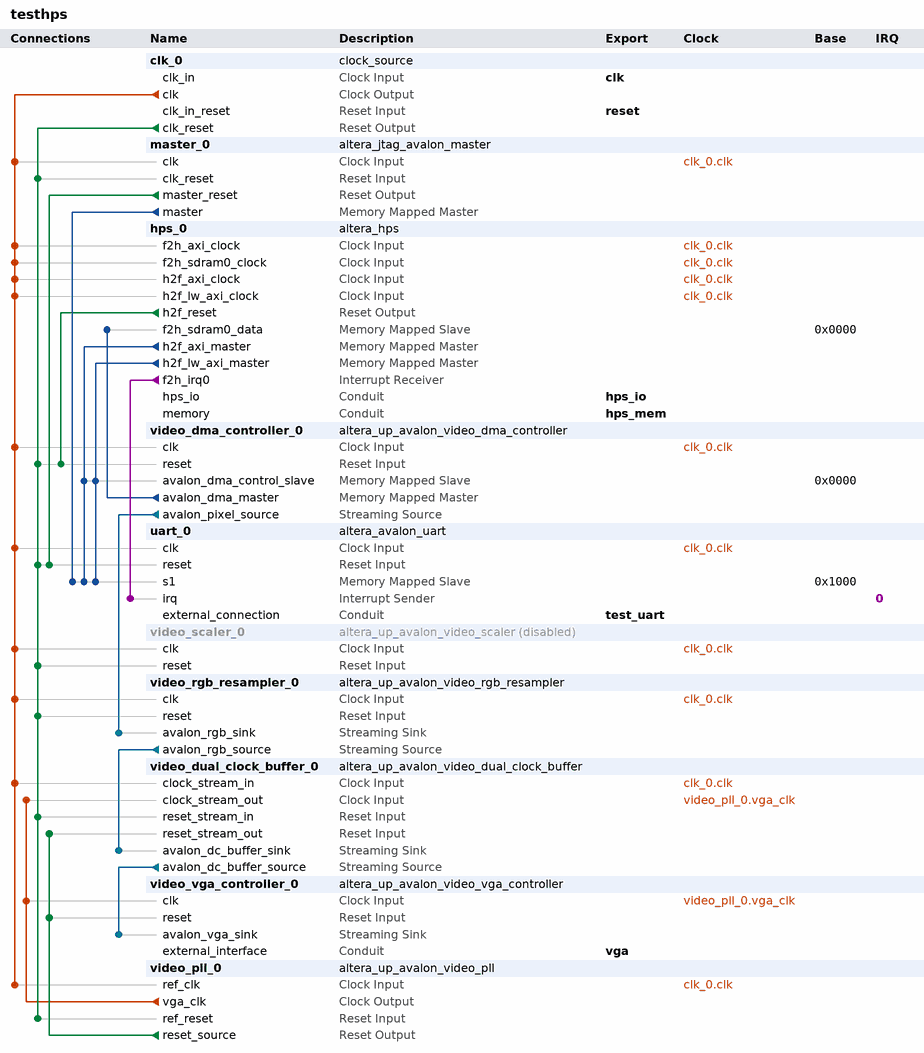
[diagram p0: system contents]
# Platform Designer (Qsys) system testhps, Cyclone V 5CSEMA5F31C6
# Parameters at their usual value, and those the tool derives, are not listed.
package require -exact qsys 15.0
create_system testhps
set_project_property DEVICE_FAMILY {Cyclone V}
set_project_property DEVICE 5CSEMA5F31C6

add_instance clk_0 clock_source 15.0
set_instance_parameter_value clk_0 clockFrequency 50000000

add_instance master_0 altera_jtag_avalon_master 15.0

add_instance hps_0 altera_hps 15.0
set_instance_parameter_value hps_0 EMAC1_Mode RGMII
set_instance_parameter_value hps_0 EMAC1_PinMuxing {HPS I/O Set 0}
set_instance_parameter_value hps_0 F2SCLK_COLDRST_Enable false
set_instance_parameter_value hps_0 F2SCLK_DBGRST_Enable false
set_instance_parameter_value hps_0 F2SCLK_WARMRST_Enable false
set_instance_parameter_value hps_0 F2SDRAM_Type {Avalon-MM Bidirectional,Avalon-MM Bidirectional}
set_instance_parameter_value hps_0 F2SDRAM_Width 32,32
set_instance_parameter_value hps_0 F2SINTERRUPT_Enable true
set_instance_parameter_value hps_0 F2S_Width 1
set_instance_parameter_value hps_0 FPGA_PERIPHERAL_OUTPUT_CLOCK_FREQ_EMAC0_GTX_CLK 100
set_instance_parameter_value hps_0 FPGA_PERIPHERAL_OUTPUT_CLOCK_FREQ_EMAC0_MD_CLK 2.5
set_instance_parameter_value hps_0 FPGA_PERIPHERAL_OUTPUT_CLOCK_FREQ_EMAC1_GTX_CLK 100
set_instance_parameter_value hps_0 FPGA_PERIPHERAL_OUTPUT_CLOCK_FREQ_EMAC1_MD_CLK 2.5
set_instance_parameter_value hps_0 HPS_PROTOCOL DDR3
set_instance_parameter_value hps_0 I2C0_Mode I2C
set_instance_parameter_value hps_0 I2C0_PinMuxing {HPS I/O Set 1}
set_instance_parameter_value hps_0 I2C1_Mode N/A
set_instance_parameter_value hps_0 I2C1_PinMuxing Unused
set_instance_parameter_value hps_0 LWH2F_Enable true
set_instance_parameter_value hps_0 MEM_BANKADDR_WIDTH 3
set_instance_parameter_value hps_0 MEM_CLK_FREQ 400.0
set_instance_parameter_value hps_0 MEM_COL_ADDR_WIDTH 10
set_instance_parameter_value hps_0 MEM_DQ_WIDTH 32
set_instance_parameter_value hps_0 MEM_DRV_STR RZQ/7
set_instance_parameter_value hps_0 MEM_ROW_ADDR_WIDTH 15
set_instance_parameter_value hps_0 MEM_RTT_NOM RZQ/4
set_instance_parameter_value hps_0 MEM_RTT_WR RZQ/4
set_instance_parameter_value hps_0 MEM_TCL 11
set_instance_parameter_value hps_0 MEM_TFAW_NS 30.0
set_instance_parameter_value hps_0 MEM_TRAS_NS 35.0
set_instance_parameter_value hps_0 MEM_TRCD_NS 13.75
set_instance_parameter_value hps_0 MEM_TRFC_NS 260.0
set_instance_parameter_value hps_0 MEM_TRP_NS 13.75
set_instance_parameter_value hps_0 MEM_VENDOR Other
set_instance_parameter_value hps_0 MEM_WTCL 8
set_instance_parameter_value hps_0 QSPI_Mode {1 SS}
set_instance_parameter_value hps_0 QSPI_PinMuxing {HPS I/O Set 0}
set_instance_parameter_value hps_0 REF_CLK_FREQ 25.0
set_instance_parameter_value hps_0 S2F_Width 1
set_instance_parameter_value hps_0 SDIO_Mode {4-bit Data}
set_instance_parameter_value hps_0 SDIO_PinMuxing {HPS I/O Set 0}
set_instance_parameter_value hps_0 SPIM1_Mode N/A
set_instance_parameter_value hps_0 SPIM1_PinMuxing Unused
set_instance_parameter_value hps_0 STM_Enable false
set_instance_parameter_value hps_0 TIMING_BOARD_AC_SKEW 0.02
set_instance_parameter_value hps_0 TIMING_BOARD_AC_TO_CK_SKEW 0.01
set_instance_parameter_value hps_0 TIMING_BOARD_DQ_TO_DQS_SKEW 0.05
set_instance_parameter_value hps_0 TIMING_BOARD_MAX_CK_DELAY 0.03
set_instance_parameter_value hps_0 TIMING_BOARD_MAX_DQS_DELAY 0.02
set_instance_parameter_value hps_0 TIMING_BOARD_SKEW_BETWEEN_DQS 0.06
set_instance_parameter_value hps_0 TIMING_BOARD_SKEW_CKDQS_DIMM_MAX 0.12
set_instance_parameter_value hps_0 TIMING_BOARD_SKEW_CKDQS_DIMM_MIN 0.06
set_instance_parameter_value hps_0 TIMING_BOARD_SKEW_WITHIN_DQS 0.01
set_instance_parameter_value hps_0 TIMING_TDH 65
set_instance_parameter_value hps_0 TIMING_TDQSCK 255
set_instance_parameter_value hps_0 TIMING_TDQSQ 125
set_instance_parameter_value hps_0 TIMING_TDS 30
set_instance_parameter_value hps_0 TIMING_TIH 140
set_instance_parameter_value hps_0 TIMING_TIS 180
set_instance_parameter_value hps_0 TIMING_TQSH 0.4
set_instance_parameter_value hps_0 UART0_Mode {No Flow Control}
set_instance_parameter_value hps_0 UART0_PinMuxing {HPS I/O Set 2}
set_instance_parameter_value hps_0 USB1_Mode SDR
set_instance_parameter_value hps_0 USB1_PinMuxing {HPS I/O Set 0}
set_instance_parameter_value hps_0 desired_cfg_clk_mhz 100.0
set_instance_parameter_value hps_0 desired_qspi_clk_mhz 400.0

add_instance video_dma_controller_0 altera_up_avalon_video_dma_controller 15.0
set_instance_parameter_value video_dma_controller_0 addr_mode Consecutive
set_instance_parameter_value video_dma_controller_0 back_start_address 0
set_instance_parameter_value video_dma_controller_0 color_bits 8
set_instance_parameter_value video_dma_controller_0 color_planes 3
set_instance_parameter_value video_dma_controller_0 dma_enabled true
set_instance_parameter_value video_dma_controller_0 height 480
set_instance_parameter_value video_dma_controller_0 mode {From Memory to Stream}
set_instance_parameter_value video_dma_controller_0 start_address 0
set_instance_parameter_value video_dma_controller_0 width 640

add_instance uart_0 altera_avalon_uart 15.0
set_instance_parameter_value uart_0 baud 115200
set_instance_parameter_value uart_0 dataBits 8
set_instance_parameter_value uart_0 fixedBaud false
set_instance_parameter_value uart_0 parity NONE
set_instance_parameter_value uart_0 stopBits 1

add_instance video_scaler_0 altera_up_avalon_video_scaler 15.0
set_instance_property video_scaler_0 ENABLED false
set_instance_parameter_value video_scaler_0 color_bits 8
set_instance_parameter_value video_scaler_0 color_planes 3
set_instance_parameter_value video_scaler_0 height_in 120
set_instance_parameter_value video_scaler_0 height_scaling 4
set_instance_parameter_value video_scaler_0 width_in 160
set_instance_parameter_value video_scaler_0 width_scaling 4

add_instance video_rgb_resampler_0 altera_up_avalon_video_rgb_resampler 15.0
set_instance_parameter_value video_rgb_resampler_0 alpha 1023
set_instance_parameter_value video_rgb_resampler_0 input_type {24-bit RGB}
set_instance_parameter_value video_rgb_resampler_0 output_type {30-bit RGB}

add_instance video_dual_clock_buffer_0 altera_up_avalon_video_dual_clock_buffer 15.0
set_instance_parameter_value video_dual_clock_buffer_0 color_bits 10

add_instance video_vga_controller_0 altera_up_avalon_video_vga_controller 15.0
set_instance_parameter_value video_vga_controller_0 board DE1-SoC
set_instance_parameter_value video_vga_controller_0 resolution {VGA 640x480}

add_instance video_pll_0 altera_up_avalon_video_pll 15.0
set_instance_parameter_value video_pll_0 camera {5MP Digital Camera}
set_instance_parameter_value video_pll_0 gui_refclk 50.0
set_instance_parameter_value video_pll_0 lcd {7" LCD on VEEK-MT and MTL Module}

# connections
add_connection clk_0.clk hps_0.f2h_axi_clock clock
add_connection clk_0.clk hps_0.f2h_sdram0_clock clock
add_connection clk_0.clk hps_0.h2f_axi_clock clock
add_connection clk_0.clk hps_0.h2f_lw_axi_clock clock
add_connection clk_0.clk master_0.clk clock
add_connection clk_0.clk uart_0.clk clock
add_connection clk_0.clk video_dma_controller_0.clk clock
add_connection clk_0.clk video_dual_clock_buffer_0.clock_stream_in clock
add_connection clk_0.clk video_pll_0.ref_clk clock
add_connection clk_0.clk video_rgb_resampler_0.clk clock
add_connection clk_0.clk video_scaler_0.clk clock
add_connection video_pll_0.vga_clk video_dual_clock_buffer_0.clock_stream_out clock
add_connection video_pll_0.vga_clk video_vga_controller_0.clk clock
add_connection clk_0.clk_reset master_0.clk_reset reset
add_connection clk_0.clk_reset uart_0.reset reset
add_connection clk_0.clk_reset video_dma_controller_0.reset reset
add_connection clk_0.clk_reset video_dual_clock_buffer_0.reset_stream_in reset
add_connection clk_0.clk_reset video_pll_0.ref_reset reset
add_connection clk_0.clk_reset video_rgb_resampler_0.reset reset
add_connection clk_0.clk_reset video_scaler_0.reset reset
add_connection hps_0.h2f_reset video_dma_controller_0.reset reset
add_connection master_0.master_reset uart_0.reset reset
add_connection video_pll_0.reset_source video_dual_clock_buffer_0.reset_stream_out reset
add_connection video_pll_0.reset_source video_vga_controller_0.reset reset
add_connection hps_0.h2f_axi_master uart_0.s1 avalon
set_connection_parameter_value hps_0.h2f_axi_master/uart_0.s1 baseAddress 0x1000
add_connection hps_0.h2f_axi_master video_dma_controller_0.avalon_dma_control_slave avalon
set_connection_parameter_value hps_0.h2f_axi_master/video_dma_controller_0.avalon_dma_control_slave baseAddress 0x0000
add_connection hps_0.h2f_lw_axi_master uart_0.s1 avalon
set_connection_parameter_value hps_0.h2f_lw_axi_master/uart_0.s1 baseAddress 0x1000
add_connection hps_0.h2f_lw_axi_master video_dma_controller_0.avalon_dma_control_slave avalon
set_connection_parameter_value hps_0.h2f_lw_axi_master/video_dma_controller_0.avalon_dma_control_slave baseAddress 0x0000
add_connection master_0.master uart_0.s1 avalon
set_connection_parameter_value master_0.master/uart_0.s1 baseAddress 0x1000
add_connection video_dma_controller_0.avalon_dma_master hps_0.f2h_sdram0_data avalon
set_connection_parameter_value video_dma_controller_0.avalon_dma_master/hps_0.f2h_sdram0_data baseAddress 0x0000
add_connection video_dma_controller_0.avalon_pixel_source video_rgb_resampler_0.avalon_rgb_sink avalon_streaming
add_connection video_dual_clock_buffer_0.avalon_dc_buffer_source video_vga_controller_0.avalon_vga_sink avalon_streaming
add_connection video_rgb_resampler_0.avalon_rgb_source video_dual_clock_buffer_0.avalon_dc_buffer_sink avalon_streaming
add_connection hps_0.f2h_irq0 uart_0.irq interrupt
set_connection_parameter_value hps_0.f2h_irq0/uart_0.irq irqNumber 0

# exported interfaces
add_interface clk clock sink
set_interface_property clk EXPORT_OF clk_0.clk_in
add_interface hps_io conduit end
set_interface_property hps_io EXPORT_OF hps_0.hps_io
add_interface hps_mem conduit end
set_interface_property hps_mem EXPORT_OF hps_0.memory
add_interface reset reset sink
set_interface_property reset EXPORT_OF clk_0.clk_in_reset
add_interface test_uart conduit end
set_interface_property test_uart EXPORT_OF uart_0.external_connection
add_interface vga conduit end
set_interface_property vga EXPORT_OF video_vga_controller_0.external_interface

set_interconnect_requirement {$system} qsys_mm.clockCrossingAdapter HANDSHAKE
set_interconnect_requirement {$system} qsys_mm.enableEccProtection FALSE
set_interconnect_requirement {$system} qsys_mm.insertDefaultSlave FALSE
set_interconnect_requirement {$system} qsys_mm.maxAdditionalLatency 1

save_system testhps.qsys
